# Altium schematic sheet Power.SchDoc
size 420 x 297 mm; SheetNumber: 5; SheetTotal: 32
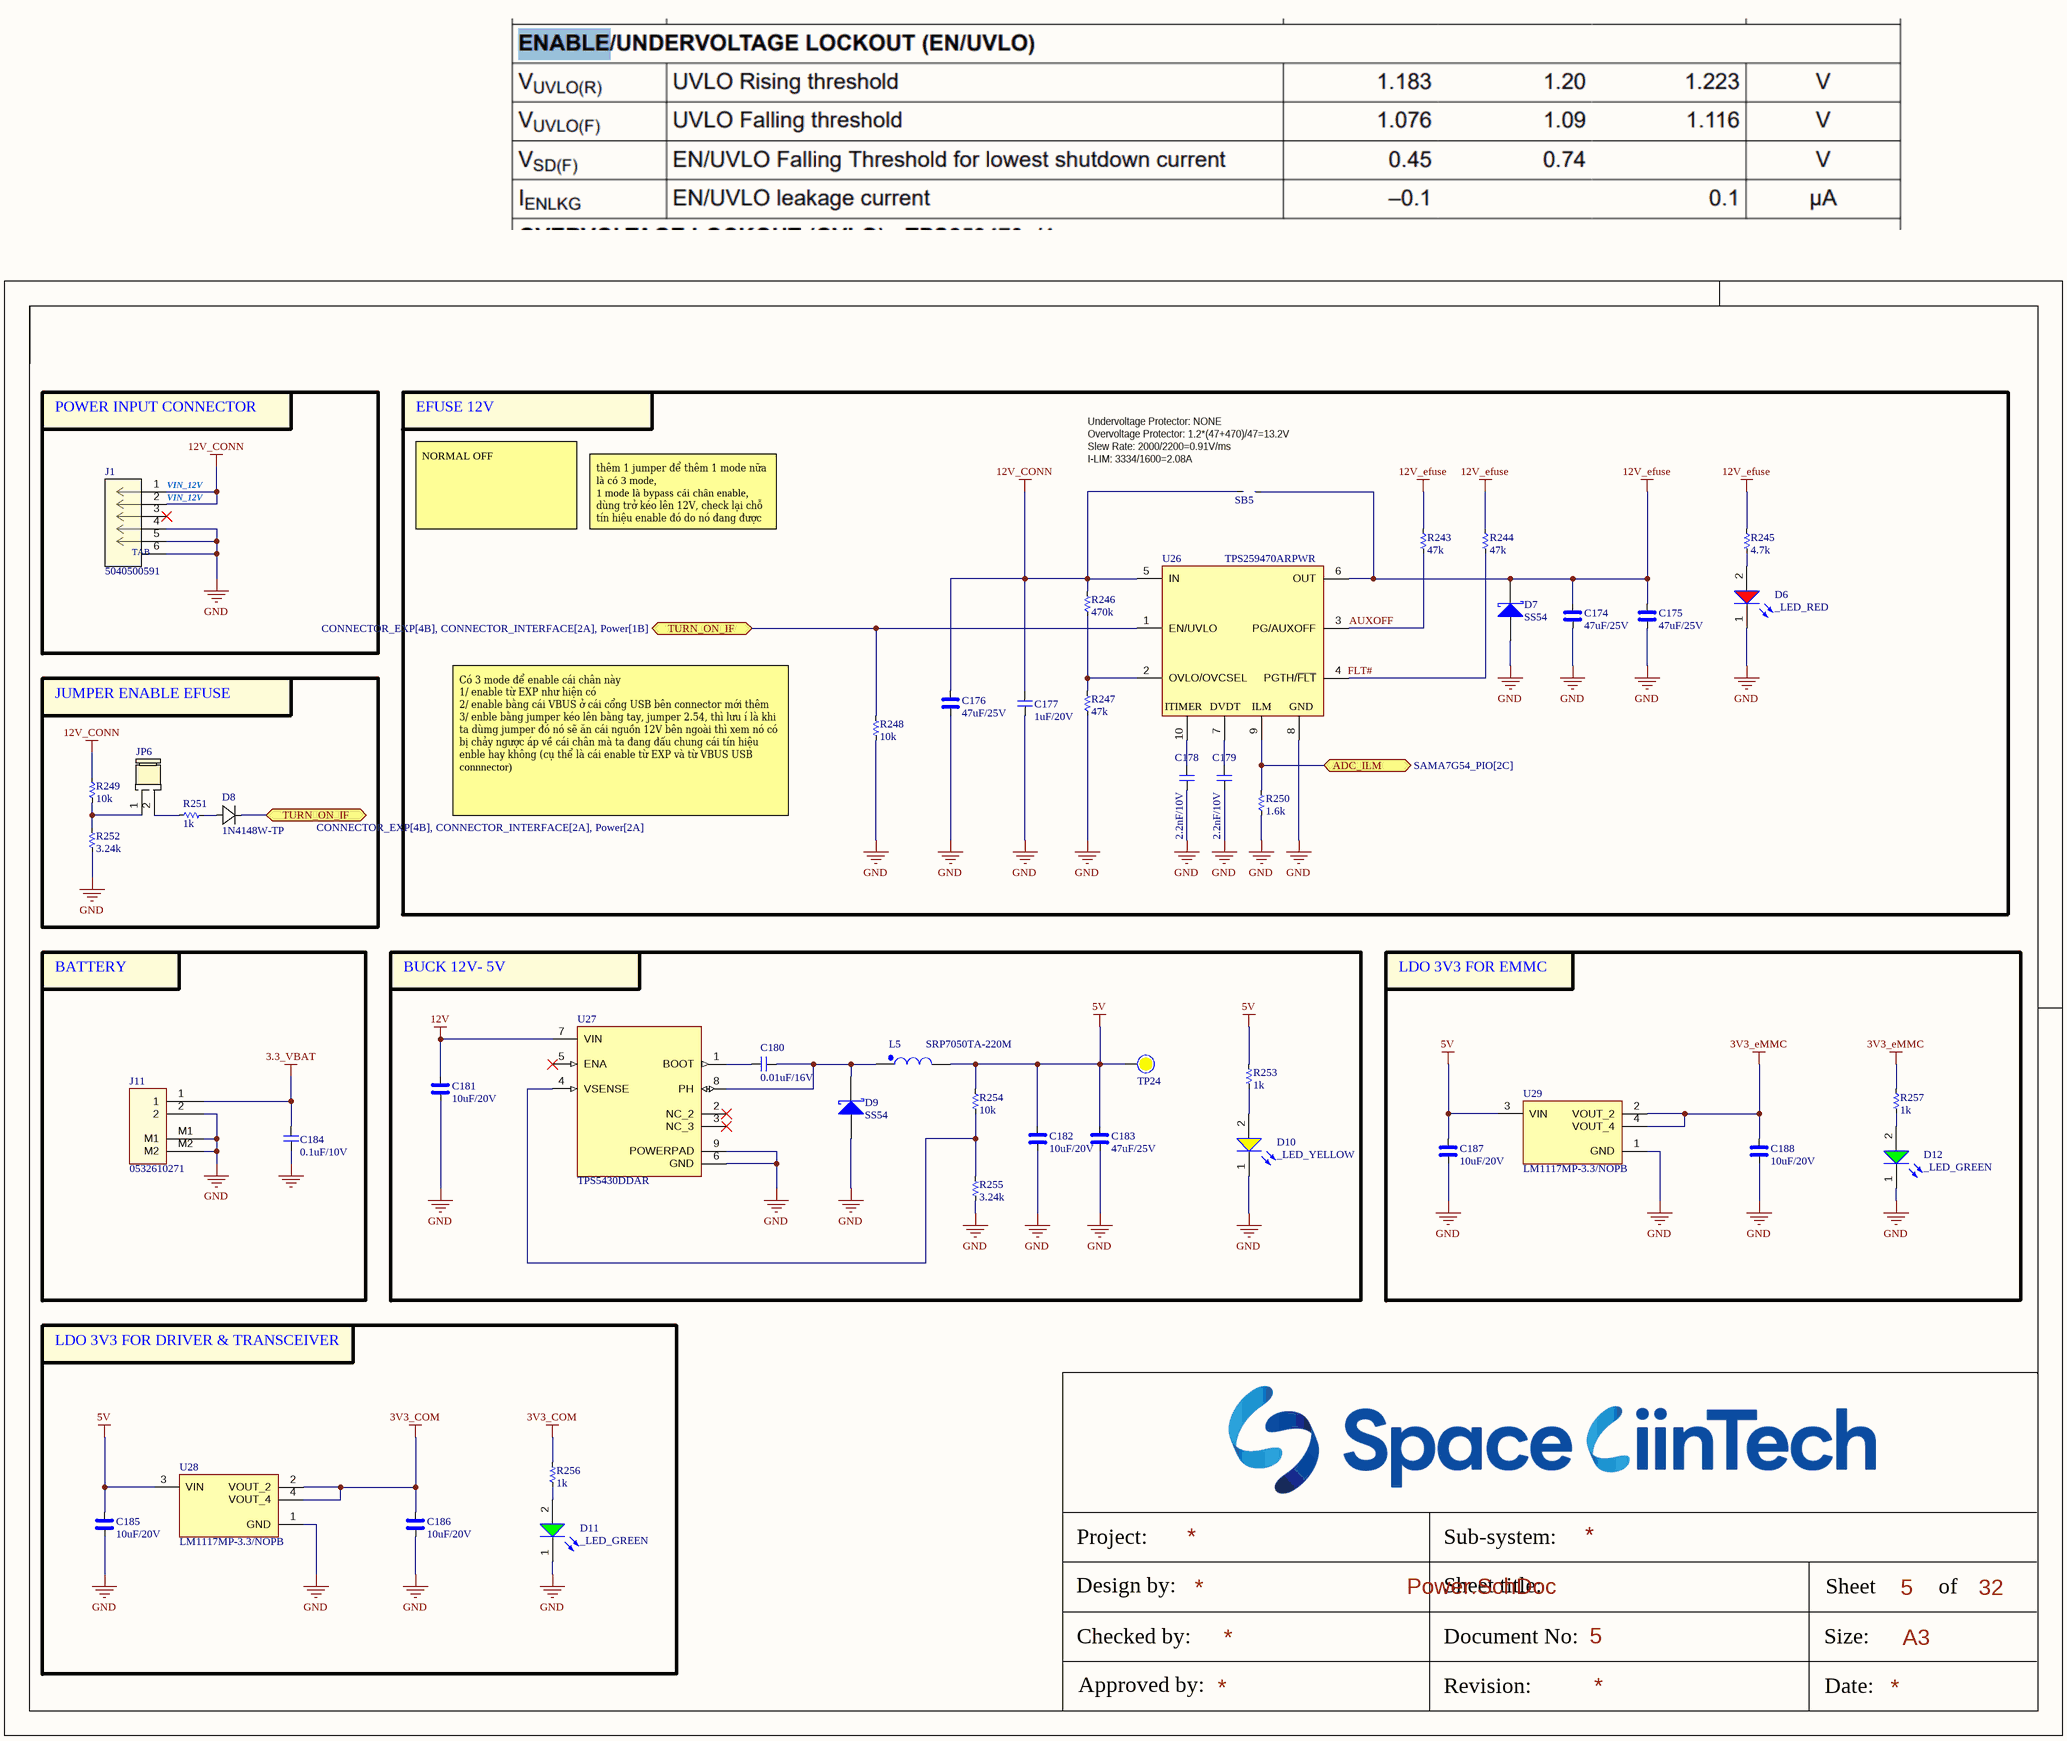
[diagram p0: Power.SchDoc]

## Parts
C174  47uF/25V  [CAP_C_3225X80]
C175  47uF/25V  [CAP_C_3225X80]
C176  47uF/25V  [CAP_C_3225X80]
C177  1uF/20V  [CAP_C_1005X50_L]
C178  2.2nF/10V  [CAP_C_1005X50_L]
C179  2.2nF/10V  [CAP_C_1005X50_L]
C180  0.01uF/16V  [CAP_C_1608X80_L]
C181  10uF/20V  [CAP_C_2012X110]
C182  10uF/20V  [CAP_C_2012X110]
C183  47uF/25V  [CAP_C_3225X80]
C184  0.1uF/10V  [CAP_C_1005X50_L]
C185  10uF/20V  [CAP_C_2012X110]
C186  10uF/20V  [CAP_C_2012X110]
C187  10uF/20V  [CAP_C_2012X110]
C188  10uF/20V  [CAP_C_2012X110]
D6  _LED_RED  [LED_0603]
D7  SS54  [DO-214AC_SMA]
D8  1N4148W-TP  [SOD123_MCC]
D9  SS54  [DO-214AC_SMA]
D10  _LED_YELLOW  [LED_0603]
D11  _LED_GREEN  [LED_0603]
D12  _LED_GREEN  [LED_0603]
J1  5040500591  [5040500591]
J11  0532610271  [MOLEX_0532610271]
JP6  JUMPER_254P_NOPLACE  [JUMPER_254P_2X1_ANGLE]  (value not drawn)
L5  SRP7050TA-220M  [SRP7050TA-220M]
R243  47k  [RES_C_1005x30_L]
R244  47k  [RES_C_1005x30_L]
R245  4.7k  [RES_C_1005x30_L]
R246  470k  [RES_C_1005x30_L]
R247  47k  [RES_C_1005x30_L]
R248  10k  [RES_C_1005x30_L]
R249  10k  [RES_C_1005x30_L]
R250  1.6k  [RES_C_1005x30_L]
R251  1k  [RES_C_1005x30_L]
R252  3.24k  [RES_C_1005x30_L]
R253  1k  [RES_C_1005x30_L]
R254  10k  [RES_C_1005x30_L]
R255  3.24k  [RES_C_1005x30_L]
R256  1k  [RES_C_1005x30_L]
R257  1k  [RES_C_1005x30_L]
SB5  JUMPER  [JUMPER_1608]  (value not drawn)
TP24  (no value)  [Testpoint_80_pin0]  (no BOM)
U26  TPS259470ARPWR  [VQFN-HR-10]
U27  TPS5430DDAR  [CONV_TPS5430DDAR]
U28  LM1117MP-3.3/NOPB  [VREG_LM1117MP-3.3/NOPB]
U29  LM1117MP-3.3/NOPB  [VREG_LM1117MP-3.3/NOPB]

## Blocks framed on the sheet
POWER INPUT CONNECTOR: J1
EFUSE 12V: C174-C179 D6 D7 R243-R248 R250 SB5 U26
JUMPER ENABLE EFUSE: D8 JP6 R249 R251 R252
BATTERY: C184 J11
BUCK 12V- 5V: C180-C183 D9 D10 L5 R253-R255 TP24 U27
LDO 3V3 FOR EMMC: C187 C188 D12 R257 U29
LDO 3V3 FOR DRIVER & TRANSCEIVER: C185 C186 D11 R256 U28

## Ports
ADC_ILM (bidir, see SAMA7G54_PIO[2C]), TURN_ON_IF (bidir, see CONNECTOR_EXP[4B], CONNECTOR_INTERFACE[2A], Power[1B]), TURN_ON_IF (bidir, see CONNECTOR_EXP[4B], CONNECTOR_INTERFACE[2A], Power[2A])

## Nets
3.3_VBAT: C184.1 J11.1
3V3_COM: C186.2 R256.2 U28.2(VOUT_2) U28.4(VOUT_4)
3V3_eMMC: C188.2 R257.2 U29.2(VOUT_2) U29.4(VOUT_4)
5V: C182.2 C183.2 C185.2 C187.2 L5.2 R253.2 R254.1 TP24.0 U28.3(VIN) U29.3(VIN)
12V: C181.2 U27.7(VIN)
12V_CONN: C176.2 C177.2 J1.1 J1.2 R246.1 R249.2 SB5.1 U26.5(IN)
12V_efuse: C174.2 C175.2 D7.1(K) R243.2 R244.2 R245.2 SB5.2 U26.6(OUT)
GND: C174.1 C175.1 C176.1 C177.1 C178.1 C179.1 C181.1 C182.1 C183.1 C184.2 C185.1 C186.1 C187.1 C188.1 D6.1(K) D7.2(A) D9.2(A) D10.1(K) D11.1(K) D12.1(K) J1.4 J1.5 J1.6 J11.2 J11.M1 J11.M2 R247.2 R248.2 R250.2 R252.2 R255.2 U26.8(GND) U27.6(GND) U27.9(POWERPAD) U28.1(GND) U29.1(GND)
ADC_ILM: R250.1 U26.9(ILM) ; port ADC_ILM
AUXOFF: R243.1 U26.3(PG/AUXOFF)
FLT#: R244.1 U26.4(PGTH/~{FLT})
TURN_ON_IF: D8.1 R248.1 U26.1(EN/UVLO) ; port TURN_ON_IF
NetC178_2: C178.2 U26.10(ITIMER)
NetC179_2: C179.2 U26.7(DVDT)
NetC180_1: C180.1 D9.1(K) L5.1 U27.8(PH)
NetC180_2: C180.2 U27.1(BOOT)
NetD6_2: D6.2(A) R245.1
NetD8_2: D8.2 R251.2
NetD10_2: D10.2(A) R253.1
NetD11_2: D11.2(A) R256.1
NetD12_2: D12.2(A) R257.1
NetJP6_1: JP6.1 R249.1 R252.1
NetJP6_2: JP6.2 R251.1
NetR246_2: R246.2 R247.1 U26.2(OVLO/OVCSEL)
NetR254_2: R254.2 R255.1 U27.4(VSENSE)

Not connected (* = marked no-connect by the designer): J1 3*; U27 2(NC_2)* 3(NC_3)* 5(ENA)*

## Notes on the sheet
- Undervoltage Protector: NONE
- Overvoltage Protector: 1.2*(47+470)/47=13.2V
- (near SB5) Slew Rate: 2000/2200=0.91V/ms
- (near J1) VIN_12V
- (near SB5) I-LIM: 3334/1600=2.08A
- NORMAL OFF
- thêm 1 jumper để thêm 1 mode nữa là có 3 mode,
  1 mode là bypass cái chân enable, dùng trở kéo lên 12V, check lại chỗ tín hiệu enable đó do nó đang được enable bởi EXP và cái VBUS bên connector
- Có 3 mode để enable cái chân này
  1/ enable từ EXP như hiện có
  2/ enable bằng cái VBUS ở cái cổng USB bên connector mới thêm
  3/ enble bằng jumper kéo lên bằng tay, jumper 2.54, thì lưu í là khi ta dùmg jumper đó nó sẽ ăn cái nguồn 12V bên ngoài thì xem nó có bị chảy ngược áp về cái chân mà ta đang đấu chung cái tín hiệu enble hay không (cụ thể là cái enable từ EXP và từ VBUS USB connnector)
- Project:
- Sub-system:
- Design by:
- Sheet title:
- Sheet
- A3
- of
- Checked by:
- Approved by:
- Revision:
- Document No:
- Size:
- Date:
- (in symbol 5040500591) TAB

## Library data of the parts
C174-C176 C181-C183 C185-C188 = _CAP_C_High_2: CAP CHIP High Value
C177-C180 = _CAP_C_2: CAP CHIP
C184 = _CAP_C_2: CAP
D6 = LED_RED: LED RED CLEAR 0603 SMD
D7 D9 = SS54: DIODE SCHOTTKY 40V 5A SMA; MPN: SS34; Solder: SMT; Value: SS34; MFR: *
D8 = 1N4148W-TP: Description; Manufacturer_Name: MCC; Copyright: Copyright (C) 2026 Ultra Librarian. All rights reserved.; Manufacturer_Part_Number: 1N4148W-TP
D10 = LED_YELLOW: LED YELLOW CLEAR 603 SMD
D11 D12 = LED_GREEN: LED GREEN CLEAR 0603 SMD
J1 = 5040500591: 1.50mm Pitch, Pico-Lock PCB Header, Single Row, Right-Angle, Surface Mount, Gold (Au) Plating, Positive Lock, 5 Circuits, Tape and Reel; Manufacturer_Name: Molex Connector Corporation; Copyright: Copyright (C) 2025 Ultra Librarian. All rights reserved.; Manufacturer_Part_Number: 5040500591; RefDes: RefDes; Type: Type
J11 = Header 2x1_2M
L5 = _IND: FIXED IND 22UH 2.5A 170 MOHM SMD
R243-R257 = _RES_B_2: RES
TP24 = Test Point: Solder: NF
U27 = TPS5430DDAR: 5.5V to 36V Input, 3A, 500kHz Step-Down Converter; MF: Texas Instruments; Package: HSOIC-8 Texas Instruments; Check_prices: https://www.snapeda.com/parts/TPS5430DDAR/Texas+Instruments/view-part/?ref=eda; Value: *; Purchase-URL: https://pricing.snapeda.com/search/part/TPS5430DDAR/?ref=eda; Availability: In Stock; SnapEDA_Link: https://www.snapeda.com/parts/TPS5430DDAR/Texas+Instruments/view-part/?ref=snap; MP: TPS5430DDAR; Price: None
U28 U29 = LM1117MP-3.3/NOPB: 800-mA 15-V linear voltage regulator; MF: Texas Instruments; SnapEDA_Link: https://www.snapeda.com/parts/LM1117MP-3.3/NOPB/Texas+Instruments/view-part/?ref=snap; Package: SOT-223-4 Texas Instruments; Value: *; MP: LM1117MP-3.3/NOPB; Check_prices: https://www.snapeda.com/parts/LM1117MP-3.3/NOPB/Texas+Instruments/view-part/?ref=eda